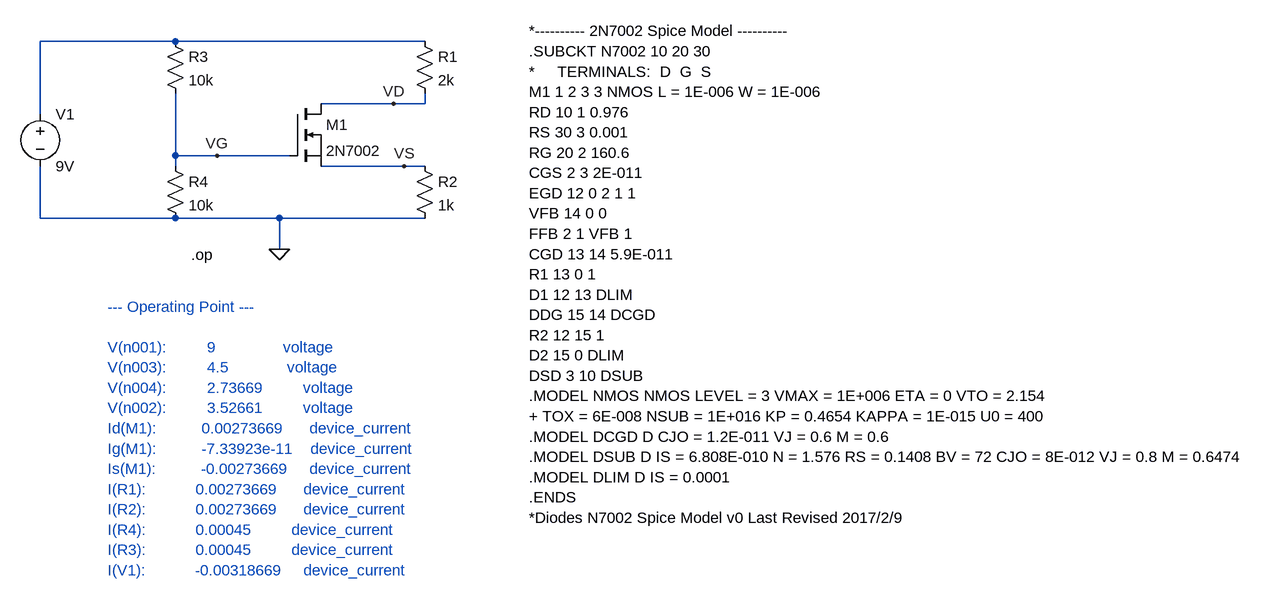
[diagram p0: schematic parte 2.asc]
parte 2.asc, the LTspice schematic file:
Version 4
SHEET 1 1728 756
WIRE 0 -32 -208 -32
WIRE 384 -32 0 -32
WIRE 336 64 224 64
WIRE 384 64 384 48
WIRE 384 64 336 64
WIRE -208 80 -208 -32
WIRE 0 144 0 48
WIRE 64 144 0 144
WIRE 176 144 64 144
WIRE 0 160 0 144
WIRE 352 160 224 160
WIRE 384 160 352 160
WIRE -208 240 -208 160
WIRE 0 240 -208 240
WIRE 160 240 0 240
WIRE 384 240 160 240
WIRE 160 288 160 240
FLAG 160 288 0
FLAG 352 160 VS
FLAG 336 64 VD
FLAG 64 144 VG
SYMBOL voltage -208 64 R0
WINDOW 123 0 0 Left 0
WINDOW 39 0 0 Left 0
SYMATTR InstName V1
SYMATTR Value 9V
SYMBOL res -16 -48 R0
SYMATTR InstName R3
SYMATTR Value 10k
SYMBOL res -16 144 R0
SYMATTR InstName R4
SYMATTR Value 10k
SYMBOL res 368 144 R0
SYMATTR InstName R2
SYMATTR Value 1k
SYMBOL res 368 -48 R0
SYMATTR InstName R1
SYMATTR Value 2k
SYMBOL nmos 176 64 R0
SYMATTR InstName M1
SYMATTR Value 2N7002
TEXT 544 -48 Left 2 !*---------- 2N7002 Spice Model ----------\n.SUBCKT N7002 10 20 30 \n*     TERMINALS:  D  G  S\nM1 1 2 3 3 NMOS L = 1E-006 W = 1E-006 \nRD 10 1 0.976 \nRS 30 3 0.001 \nRG 20 2 160.6 \nCGS 2 3 2E-011 \nEGD 12 0 2 1 1 \nVFB 14 0 0 \nFFB 2 1 VFB 1 \nCGD 13 14 5.9E-011 \nR1 13 0 1 \nD1 12 13 DLIM \nDDG 15 14 DCGD \nR2 12 15 1 \nD2 15 0 DLIM \nDSD 3 10 DSUB \n.MODEL NMOS NMOS LEVEL = 3 VMAX = 1E+006 ETA = 0 VTO = 2.154 \n+ TOX = 6E-008 NSUB = 1E+016 KP = 0.4654 KAPPA = 1E-015 U0 = 400 \n.MODEL DCGD D CJO = 1.2E-011 VJ = 0.6 M = 0.6 \n.MODEL DSUB D IS = 6.808E-010 N = 1.576 RS = 0.1408 BV = 72 CJO = 8E-012 VJ = 0.8 M = 0.6474 \n.MODEL DLIM D IS = 0.0001 \n.ENDS\n*Diodes N7002 Spice Model v0 Last Revised 2017/2/9
TEXT 24 296 Left 2 !.op
TEXT -104 376 Left 2 ;--- Operating Point ---\n \nV(n001):         9               voltage\nV(n003):         4.5             voltage\nV(n004):         2.73669         voltage\nV(n002):         3.52661         voltage\nId(M1):          0.00273669      device_current\nIg(M1):          -7.33923e-11    device_current\nIs(M1):          -0.00273669     device_current\nI(R1):           0.00273669      device_current\nI(R2):           0.00273669      device_current\nI(R4):           0.00045         device_current\nI(R3):           0.00045         device_current\nI(V1):           -0.00318669     device_current

The netlist it stands for:
* parte 2.asc
V1 N001 0 9V
R3 N001 VG 10k
R4 VG 0 10k
R2 VS 0 1k
R1 N001 VD 2k
M1 VD VG VS VS 2N7002
.model NMOS NMOS
.model PMOS PMOS
.lib standard.mos
*---------- 2N7002 Spice Model ----------
.SUBCKT N7002 10 20 30
*     TERMINALS:  D  G  S
M1 1 2 3 3 NMOS L = 1E-006 W = 1E-006
RD 10 1 0.976
RS 30 3 0.001
RG 20 2 160.6
CGS 2 3 2E-011
EGD 12 0 2 1 1
VFB 14 0 0
FFB 2 1 VFB 1
CGD 13 14 5.9E-011
R1 13 0 1
D1 12 13 DLIM
DDG 15 14 DCGD
R2 12 15 1
D2 15 0 DLIM
DSD 3 10 DSUB
.MODEL NMOS NMOS LEVEL = 3 VMAX = 1E+006 ETA = 0 VTO = 2.154
+ TOX = 6E-008 NSUB = 1E+016 KP = 0.4654 KAPPA = 1E-015 U0 = 400
.MODEL DCGD D CJO = 1.2E-011 VJ = 0.6 M = 0.6
.MODEL DSUB D IS = 6.808E-010 N = 1.576 RS = 0.1408 BV = 72 CJO = 8E-012 VJ = 0.8 M = 0.6474
.MODEL DLIM D IS = 0.0001
.ENDS
*Diodes N7002 Spice Model v0 Last Revised 2017/2/9
.op
* --- Operating Point ---
* V(n001):         9               voltage
* V(n003):         4.5             voltage
* V(n004):         2.73669         voltage
* V(n002):         3.52661         voltage
* Id(M1):          0.00273669      device_current
* Ig(M1):          -7.33923e-11    device_current
* Is(M1):          -0.00273669     device_current
* I(R1):           0.00273669      device_current
* I(R2):           0.00273669      device_current
* I(R4):           0.00045         device_current
* I(R3):           0.00045         device_current
* I(V1):           -0.00318669     device_current
.backanno
.end